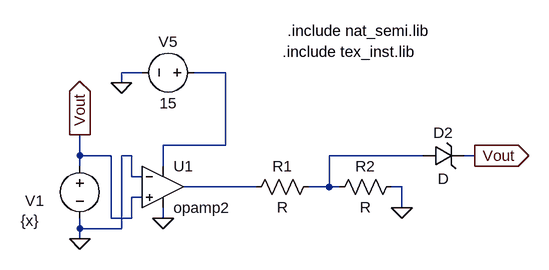
[diagram p0: schematic Draft.asc]
Draft.asc, the LTspice schematic file:
Version 4.1
SHEET 1 880 680
WIRE 240 -176 208 -176
WIRE 368 -176 320 -176
WIRE 208 -160 208 -176
WIRE 368 -64 368 -176
WIRE 368 -64 272 -64
WIRE 144 -48 144 -80
WIRE 192 -48 144 -48
WIRE 224 -48 208 -48
WIRE 672 -48 528 -48
WIRE 752 -48 736 -48
WIRE 144 -32 144 -48
WIRE 272 -32 272 -64
WIRE 224 -16 224 -48
WIRE 240 -16 224 -16
WIRE 416 0 304 0
WIRE 528 0 528 -48
WIRE 528 0 496 0
WIRE 544 0 528 0
WIRE 640 0 624 0
WIRE 240 16 224 16
WIRE 640 32 640 0
WIRE 192 48 192 -48
WIRE 224 48 224 16
WIRE 224 48 192 48
WIRE 272 48 272 32
WIRE 144 64 144 48
WIRE 208 64 208 -48
WIRE 208 64 144 64
WIRE 144 80 144 64
FLAG 144 -80 Vout
IOPIN 144 -80 Out
FLAG 640 32 0
FLAG 272 48 0
FLAG 208 -160 0
FLAG 144 80 0
FLAG 752 -48 Vout
IOPIN 752 -48 Out
SYMBOL voltage 144 -48 R0
WINDOW 123 0 0 Left 0
WINDOW 39 0 0 Left 0
WINDOW 0 -84 69 Left 2
WINDOW 3 -91 100 Left 2
SYMATTR InstName V1
SYMATTR Value {x}
SYMBOL OpAmps\\opamp2 272 -64 R0
SYMATTR InstName U1
SYMBOL res 512 -16 R90
WINDOW 0 0 56 VBottom 2
WINDOW 3 32 56 VTop 2
SYMATTR InstName R1
SYMBOL res 640 -16 R90
WINDOW 0 0 56 VBottom 2
WINDOW 3 32 56 VTop 2
SYMATTR InstName R2
SYMBOL voltage 336 -176 R90
WINDOW 0 -32 56 VBottom 2
WINDOW 3 32 56 VTop 2
SYMATTR InstName V5
SYMATTR Value 15
SYMBOL zener 672 -32 R270
WINDOW 0 36 32 VTop 2
WINDOW 3 -4 32 VBottom 2
SYMATTR InstName D2
TEXT 464 -240 Left 2 !.include nat_semi.lib
TEXT 456 -208 Left 2 !.include tex_inst.lib

The netlist it stands for:
* Draft.asc
V1 Vout 0 {x}
X§U1 Vout 0 N001 0 N003 opamp2  ; pins In+ In- V+ V- OUT
R1 N002 N003 R
R2 0 N002 R
V5 N001 0 15
D2 N002 Vout D
.model D D
.lib standard.dio
.include nat_semi.lib
.include tex_inst.lib
.backanno
.end